# Altium schematic sheet BEE_BOARD_TOP.SchDoc
size Tabloid; DocumentNumber: 3; SheetNumber: 3; SheetTotal: 7; Sheet_Name: Top; Size: 11x17
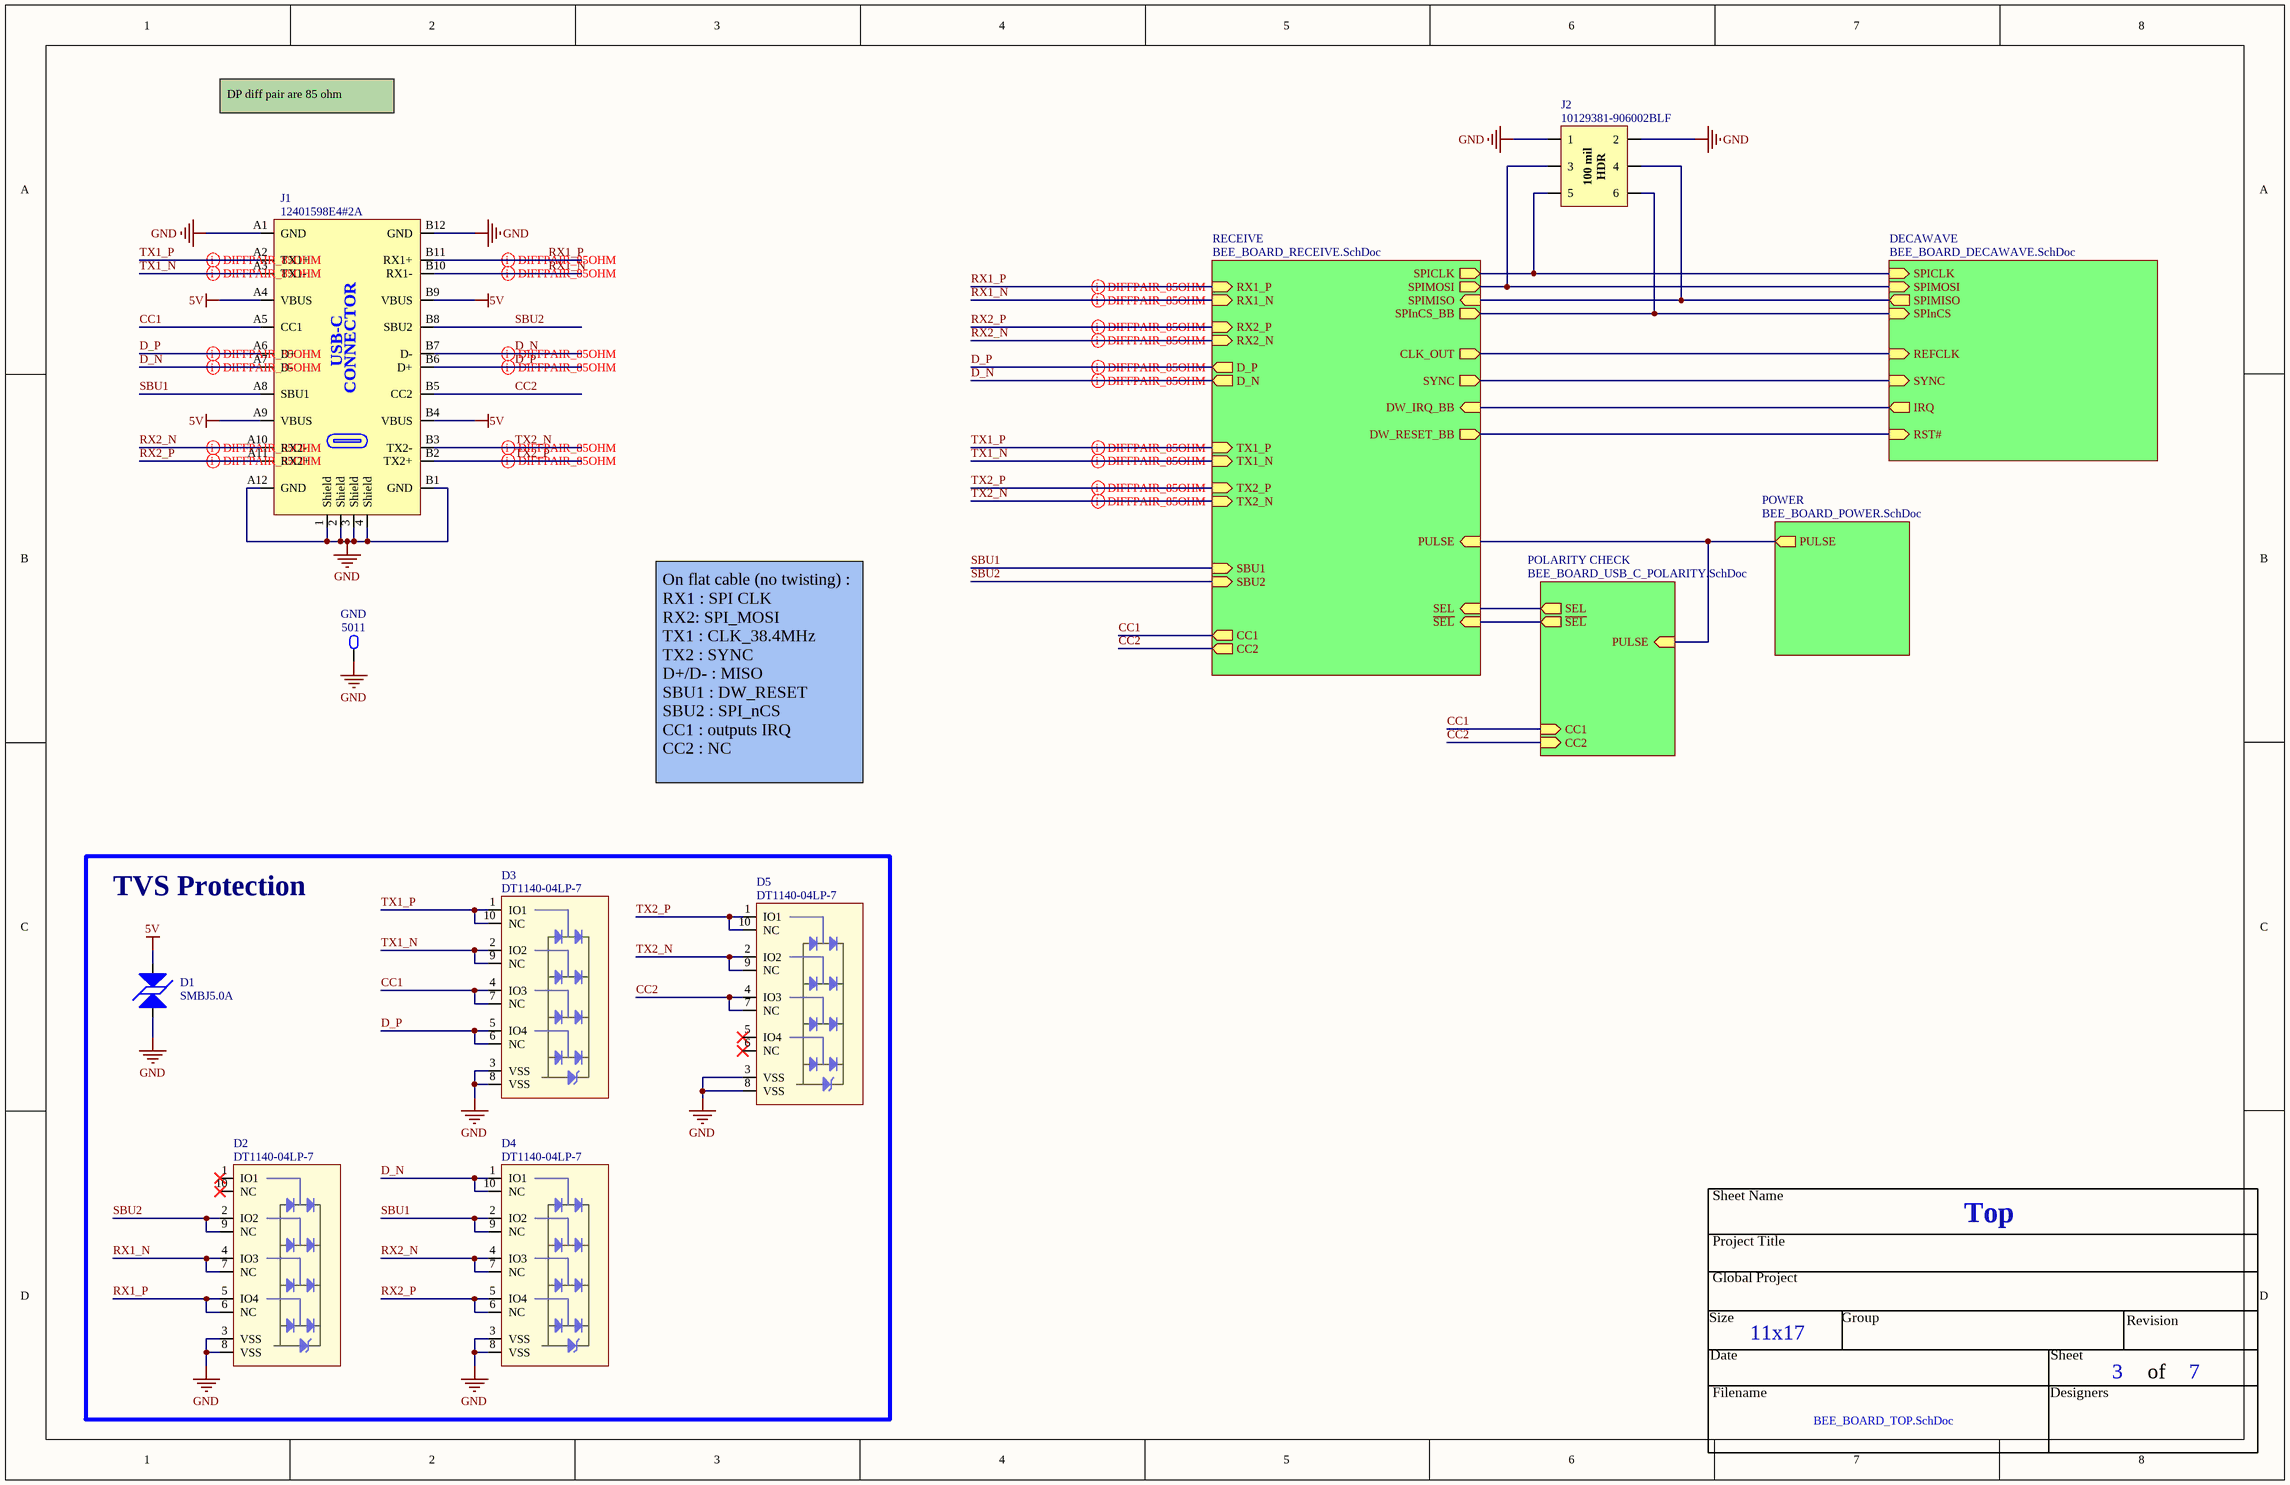
[diagram p0: BEE_BOARD_TOP.SchDoc]

## Parts
D1  SMBJ5.0A  [TVS_PWR_SMBJ5.0CA]
D2  DT1140-04LP-7  [TVS_DATA_DT1140-04LP-7]
D3  DT1140-04LP-7  [TVS_DATA_DT1140-04LP-7]
D4  DT1140-04LP-7  [TVS_DATA_DT1140-04LP-7]
D5  DT1140-04LP-7  [TVS_DATA_DT1140-04LP-7]
GND  5011  [TPO_5011]
J1  12401598E4#2A  [CON_USB_3.2_TypeC_12401598E4#2A]
J2  10129381-906002BLF  [CON_HDR_10129381-906002BLF]

## Blocks framed on the sheet
TVS Protection: D1-D5

## Sub-sheets
DECAWAVE = BEE_BOARD_DECAWAVE.SchDoc: SYNC (in), SPICLK (in), SPIMISO (out), SPIMOSI (in), RST# (in), REFCLK (in), SPInCS (in), IRQ (out)
POLARITY CHECK = BEE_BOARD_USB_C_POLARITY.SchDoc: CC1 (in), CC2 (in), ~{SEL} (out), SEL (out), PULSE (in)
POWER = BEE_BOARD_POWER.SchDoc: PULSE (out)
RECEIVE = BEE_BOARD_RECEIVE.SchDoc: SPIMISO (in), SPIMOSI (out), SPICLK (out), CLK_OUT (out), SYNC (out), DW_IRQ_BB (in), SPInCS_BB (out), DW_RESET_BB (out), CC1 (out), CC2 (out), TX1_P (in), SBU2 (in), SEL (in), TX2_N (in), ~{SEL} (in), RX2_P (in), RX1_P (in), TX1_N (in), TX2_P (in), RX2_N (in), RX1_N (in), D_P (out), D_N (out), SBU1 (in), PULSE (in)

## Nets
5V: D1.1 J1.A4(VBUS) J1.A9(VBUS) J1.B4(VBUS) J1.B9(VBUS)
GND: D1.2 D2.3(VSS) D2.8(VSS) D3.3(VSS) D3.8(VSS) D4.3(VSS) D4.8(VSS) D5.3(VSS) D5.8(VSS) GND.1 J1.1(Shield) J1.2(Shield) J1.3(Shield) J1.4(Shield) J1.A1(GND) J1.A12(GND) J1.B1(GND) J1.B12(GND) J2.1 J2.2
CC1: D3.4(IO3) D3.7(NC) J1.A5(CC1) ; sheet RECEIVE/CC1, sheet POLARITY CHECK/CC1
CC2: D5.4(IO3) D5.7(NC) J1.B5(CC2) ; sheet RECEIVE/CC2, sheet POLARITY CHECK/CC2
D_N: D4.1(IO1) D4.10(NC) J1.A7(D-) J1.B7(D-) ; sheet RECEIVE/D_N
D_P: D3.5(IO4) D3.6(NC) J1.A6(D+) J1.B6(D+) ; sheet RECEIVE/D_P
RX1_N: D2.4(IO3) D2.7(NC) J1.B10(RX1-) ; sheet RECEIVE/RX1_N
RX1_P: D2.5(IO4) D2.6(NC) J1.B11(RX1+) ; sheet RECEIVE/RX1_P
RX2_N: D4.4(IO3) D4.7(NC) J1.A10(RX2-) ; sheet RECEIVE/RX2_N
RX2_P: D4.5(IO4) D4.6(NC) J1.A11(RX2+) ; sheet RECEIVE/RX2_P
SBU1: D4.2(IO2) D4.9(NC) J1.A8(SBU1) ; sheet RECEIVE/SBU1
SBU2: D2.2(IO2) D2.9(NC) J1.B8(SBU2) ; sheet RECEIVE/SBU2
TX1_N: D3.2(IO2) D3.9(NC) J1.A3(TX1-) ; sheet RECEIVE/TX1_N
TX1_P: D3.1(IO1) D3.10(NC) J1.A2(TX1+) ; sheet RECEIVE/TX1_P
TX2_N: D5.2(IO2) D5.9(NC) J1.B3(TX2-) ; sheet RECEIVE/TX2_N
TX2_P: D5.1(IO1) D5.10(NC) J1.B2(TX2+) ; sheet RECEIVE/TX2_P
NetJ2_3: J2.3 ; sheet RECEIVE/SPIMOSI, sheet DECAWAVE/SPIMOSI
NetJ2_4: J2.4 ; sheet RECEIVE/SPIMISO, sheet DECAWAVE/SPIMISO
NetJ2_5: J2.5 ; sheet RECEIVE/SPICLK, sheet DECAWAVE/SPICLK
NetJ2_6: J2.6 ; sheet RECEIVE/SPInCS_BB, sheet DECAWAVE/SPInCS
(unnamed): sheet POWER/PULSE, sheet RECEIVE/PULSE, sheet POLARITY CHECK/PULSE
(unnamed): sheet RECEIVE/CLK_OUT, sheet DECAWAVE/REFCLK
(unnamed): sheet RECEIVE/SYNC, sheet DECAWAVE/SYNC
(unnamed): sheet RECEIVE/DW_IRQ_BB, sheet DECAWAVE/IRQ
(unnamed): sheet RECEIVE/DW_RESET_BB, sheet DECAWAVE/RST#
(unnamed): sheet RECEIVE/SEL, sheet POLARITY CHECK/SEL
(unnamed): sheet RECEIVE/~{SEL}, sheet POLARITY CHECK/~{SEL}

Not connected (* = marked no-connect by the designer): D2 1(IO1)* 10(NC)*; D5 5(IO4)* 6(NC)*

## Layout directives
differential pair; differential pair class DIFF_85: D_N, D_P, RX1_N, RX1_P, RX2_N, RX2_P, TX1_N, TX1_P, TX2_N, TX2_P

## Notes on the sheet
- DP diff pair are 85 ohm
- On flat cable (no twisting) :
  RX1 : SPI CLK
  RX2: SPI_MOSI
  TX1 : CLK_38.4MHz
  TX2 : SYNC
  D+/D- : MISO
  SBU1 : DW_RESET
  SBU2 : SPI_nCS
  CC1 : outputs IRQ
  CC2 : NC
- Sheet Name
- Project Title
- Global Project
- Revision
- Size
- Date
- Group
- Sheet
- of
- Filename
- Designers
- (in symbol CON_HDR_10129381-906002BLF) 100 mil; HDR
- (in symbol CON_USB_3.2_TypeC_12401598E4#2A) USB-C; CONNECTOR

## Library data of the parts
D1 = TVS_PWR_SMBJ5.0A: TVS - BIDIR 5V 9.2V 600W - DO214AA; Manufacturer #1: Littelfuse Inc.; Value: Vbr = 6.4V -  Clamp = 9.2V; Voltage Rating: 5V Standoff; Current Rating: 100A (peak); Power Max: 600W (Pppm); GRAMS Lib Spec: 2.8c; Magnetic Material: UNKNOWN; Polarized: NO; Tolerance: *; HelpURL: https://www.littelfuse.com/~/media/electronics/datasheets/tvs_diodes/littelfuse_tvs_diode_smbj_datasheet.pdf.pdf; CreatedBy/Date: Louis-Daniel Gaulin / 13-04-2021; VerifiedBy: Philippe Arsenault/2021-04-14; Temperature: -65°C ~ 150°C (TJ); Package: DO214AA; Manufacturer #2: *; Note: *; Assembly Type: SMD; Part Number #2: *; Part Number #1: SMBJ5.0A; Supplier 1: Digi-Key; Supplier Part Number 1: SMBJ5.0ALFCT-ND; Cryo: UNKNOWN
D2-D5 = TVS_DATA_DT1140-04LP-7: TVS - DIODE 5.5V 10V - 10-UFDFN; Manufacturer #1: Diodes Incorporated; Value: 5.5V @ 1mA (Reverse Standoff); Voltage Rating: 6V (Breakdown); Current Rating: 6A (8/20µs); Power Max: 60W (8/20µs); GRAMS Lib Spec: 2.8; Note: Fooprint created from tpd4e05u06 (TI) for manufacturability (soldermask); Magnetic Material: Unknown; Polarized: Yes; Tolerance: -; HelpURL: https://www.diodes.com/assets/Datasheets/DT1140-04LP.pdf; CreatedBy/Date: Joël Lemay 2019-11-20; VerifiedBy: C.Paulin - 21/11/2019; Temperature: -55°C~85°C; Package: 10-UFDFN; Manufacturer #2: -; Assembly Type: SMD; Part Number #2: -; Part Number #1: DT1140-04LP-7; Supplier 1: Digi-Key; Supplier Part Number 1: DT1140-04LP-7DICT-ND; Cryo: UNKNOWN
GND = TPO_5011: TPO - TEST POINT - TH; Manufacturer #1: Keystone Electronics; Polarized: No; Magnetic Material: UNKNOWN; GRAMS Lib Spec: 2.8; Current Rating: *; Manufacturer #2: *; Note: *; Power Max: *; Value: *; Part Number #1: 5011; Part Number #2: *; HelpURL: https://www.keyelco.com/userAssets/file/M65p56.pdf; Assembly Type: TH; Package: *; CreatedBy/Date: Louis-Daniel Gauli / 02-11-2020; Temperature: *; Tolerance: *; VerifiedBy: Philippe Arsenault/2020-11-06; Voltage Rating: *; Cryo: UNKNOWN; Supplier 1: Digi-Key; Supplier Part Number 1: 36-5011-ND
J1 = CON_USB_3.2_TypeC_12401598E4#2A: CON_USB - USB 3.2 Gen 2 (USB 3.1 Gen 2, Superspeed + (USB 3.1)) 24 pos Receptacle - R/A; Manufacturer #1: Amphenol ICC (Commercial Products); Value: USB 3.2 Type C; Current Rating: 5A total; GRAMS Lib Spec: 2.8; Magnetic Material: Unknown; Polarized: Yes; Voltage Rating: -; Power Max: -; HelpURL: https://www.amphenol-icc.com/media/wysiwyg/files/drawing/12401598xxx2a.pdf; CreatedBy/Date: Louis-Daniel Gaulin / 07-04-2021; VerifiedBy: Philippe Arsenault/2021-04-08; Temperature: max 105°C; Package: SMD + TH R/A; Assembly Type: SMD + TH; Part Number #1: 12401598E4#2A; Supplier 1: Digi-Key; Supplier Part Number 1: 12401598E4#2ACT-ND
J2 = CON_HDR_10129381-906002BLF: CON - Header 6 positions 3x2  0.100" - 6-TH; Manufacturer #1: Amphenol ICC (FCI); Current Rating: 3A; GRAMS Lib Spec: 2.8c; Magnetic Material: Unknown; Polarized: Yes; Value: 6 Pos.; Assembly Type: TH; CreatedBy/Date: Philippe Arsenault/2021-04-14; HelpURL: https://cdn.amphenol-icc.com/media/wysiwyg/files/drawing/10129381.pdf; Manufacturer #2: *; Package: 6- TH; Part Number #2: *; Power Max: *; Temperature: -55°C ~ 105°C; Tolerance: *; Part Number #1: 10129381-906002BLF; Cryo: UNKNOWN; Supplier 1: Digi-Key; Supplier Part Number 1: 10129381-906002BLF-ND